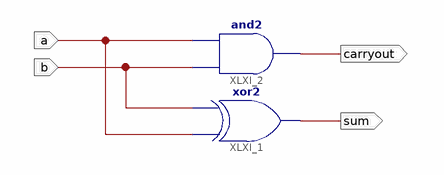
[diagram p0: schematic sheet 1]
// Xilinx ISE schematic half_adder.sch (spartan6) as structural Verilog: 2 symbols, 4 ports
module half_adder (
  input  a,
  input  b,
  output sum,
  output carryout
);

  xor XLXI_1 (sum, a, b);
  and XLXI_2 (carryout, b, a);
endmodule
